# EAGLE design edison_mezzanine_pi_breakout (EAGLE 6.5.0)

## Sheet 1 of 2
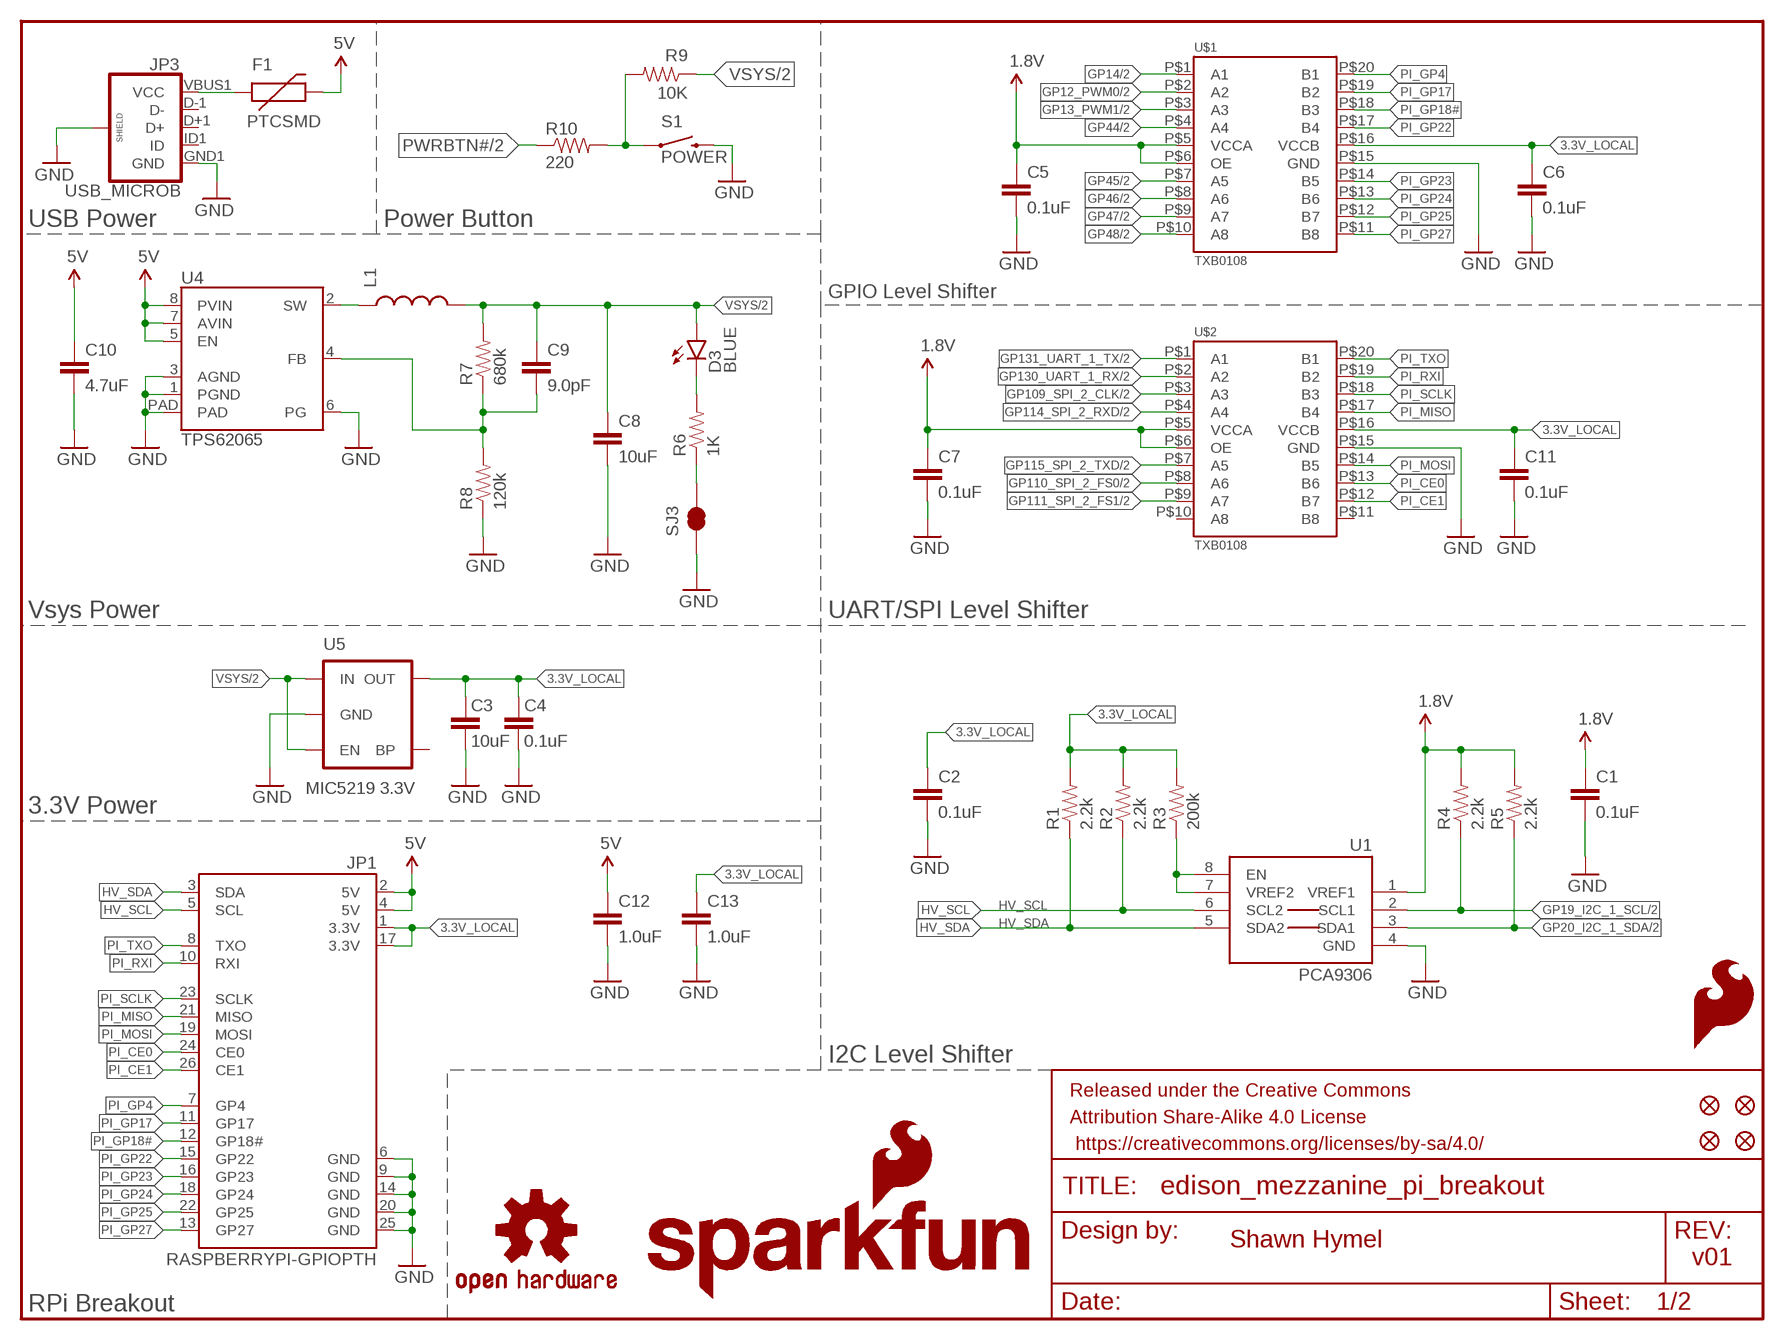
[diagram p0: schematic, sheet 1]

### Parts
C1  0.1uF  0.1UF-25V(+80/-20%)(0603)  [0603-CAP]
C2  0.1uF  0.1UF-25V(+80/-20%)(0603)  [0603-CAP]
C3  10uF  CAP0805  [0805]
C4  0.1uF  0.1UF-25V(+80/-20%)(0603)  [0603-CAP]
C5  0.1uF  0.1UF-25V(+80/-20%)(0603)  [0603-CAP]
C6  0.1uF  0.1UF-25V(+80/-20%)(0603)  [0603-CAP]
C7  0.1uF  0.1UF-25V(+80/-20%)(0603)  [0603-CAP]
C8  10uF  10UF-6.3V-20%(1206)  [1206]
C9  9.0pF  9.0PF-50V-10%(0603)  [0603-CAP]
C10  4.7uF  4.7UF-6.3V-10%(0603)0603  [0603-CAP]
C11  0.1uF  0.1UF-25V(+80/-20%)(0603)  [0603-CAP]
C12  1.0uF  1.0UF-16V-10%(0603)  [0603-CAP]
C13  1.0uF  1.0UF-16V-10%(0603)  [0603-CAP]
D3  BLUE  LED-BLUE0603  [LED-0603]
F1  PTCSMD  [PTC-1206]
FID1  FIDUCIAL1X2  [FIDUCIAL-1X2]
FID2  FIDUCIAL1X2  [FIDUCIAL-1X2]
FID3  FIDUCIAL1X2  [FIDUCIAL-1X2]
FID4  FIDUCIAL1X2  [FIDUCIAL-1X2]
FRAME1  FRAME-LETTER  [CREATIVE_COMMONS]
JP1  RASPBERRYPI-GPIOPTH  [2X13-SHROUDED]
JP3  USB_MICROB  USB_MICROB_PLUGCONN-11752  [USB-B-MICRO-SMD_V03]
L1  INDUCTOR  [INDUCTOR-SRP4020]
LOGO1  OSHW-LOGOS  [OSHW-LOGO-S]
LOGO3  SFE_LOGO_FLAME.1_INCH  [SFE_LOGO_FLAME_.1]
LOGO4  SFE_LOGO_NAME_FLAME.1_INCH  [SFE_LOGO_NAME_FLAME_.1]
R1  2.2k  2.2KOHM1/10W1%(0603)  [0603-RES]
R2  2.2k  2.2KOHM1/10W1%(0603)  [0603-RES]
R3  200k  200KOHM1/10W1%(0603)200K  [0603-RES]
R4  2.2k  2.2KOHM1/10W1%(0603)  [0603-RES]
R5  2.2k  2.2KOHM1/10W1%(0603)  [0603-RES]
R6  1K  1KOHM1/10W1%(0603)  [0603-RES]
R7  680k  RESISTOR0603  [0603-RES]
R8  120k  RESISTOR0603  [0603-RES]
R9  10K  10KOHM1/10W1%(0603)0603  [0603-RES]
R10  220  RESISTOR0603  [0603-RES]
S1  POWER  SWITCH-MOMENTARY-2-SMD-1101NE  [TACTILE-SWITCH-1101NE]
SJ3  JUMPER-PAD-2-NC_BY_TRACE  [PAD-JUMPER-2-NC_BY_TRACE_YES_SILK]
U1  PCA9306  PCA9306PCA9306DC-1:1  [PCA9306DC-1:1]
U4  TPS62065  [WSON-8-PAD]
U5  MIC5219 3.3V  V_REG_MIC52193.3V  [SOT23-5]
U$1  TXB0108  [UFDFN-20]
U$2  TXB0108  [UFDFN-20]

### Nets
1.8V: C1.1 C5.1 C7.1 R4.2 R5.2 U1.1(VREF1) U$1.P$5(VCCA) U$1.P$6(OE) U$2.P$5(VCCA) U$2.P$6(OE) ; also sheet 2
3.3V_LOCAL: C2.1 C3.1 C4.1 C6.1 C11.1 C13.1 JP1.1(3.3V) JP1.17(3.3V) R1.2 R2.2 R3.2 U5.5(OUT) U$1.P$16(VCCB) U$2.P$16(VCCB)
5V: C10.1 C12.1 F1.2 JP1.2(5V) JP1.4(5V) U4.5(EN) U4.7(AVIN) U4.8(PVIN)
GND: C1.2 C2.2 C3.2 C4.2 C5.2 C6.2 C7.2 C8.2 C10.2 C11.2 C12.2 C13.2 JP1.6(GND) JP1.9(GND) JP1.14(GND) JP1.20(GND) JP1.25(GND) JP3.GND1(GND) JP3.SHIELD1(SHIELD) JP3.SHIELD2(SHIELD) JP3.SHIELD3(SHIELD) R8.1 S1.P$2 SJ3.1 U1.4(GND) U4.1(PGND) U4.3(AGND) U4.6(PG) U4.PAD U5.2(GND) U$1.P$15(GND) U$2.P$15(GND) ; also sheet 2
GP12_PWM0: U$1.P$2(A2) ; also sheet 2
GP13_PWM1: U$1.P$3(A3) ; also sheet 2
GP14: U$1.P$1(A1) ; also sheet 2
GP19_I2C_1_SCL: R4.1 U1.2(SCL1) ; also sheet 2
GP20_I2C_1_SDA: R5.1 U1.3(SDA1) ; also sheet 2
GP44: U$1.P$4(A4) ; also sheet 2
GP45: U$1.P$7(A5) ; also sheet 2
GP46: U$1.P$8(A6) ; also sheet 2
GP47: U$1.P$9(A7) ; also sheet 2
GP48: U$1.P$10(A8) ; also sheet 2
GP109_SPI_2_CLK: U$2.P$3(A3) ; also sheet 2
GP110_SPI_2_FS0: U$2.P$8(A6) ; also sheet 2
GP111_SPI_2_FS1: U$2.P$9(A7) ; also sheet 2
GP114_SPI_2_RXD: U$2.P$4(A4) ; also sheet 2
GP115_SPI_2_TXD: U$2.P$7(A5) ; also sheet 2
GP130_UART_1_RX: U$2.P$2(A2) ; also sheet 2
GP131_UART_1_TX: U$2.P$1(A1) ; also sheet 2
HV_SCL: JP1.5(SCL) R2.1 U1.6(SCL2)
HV_SDA: JP1.3(SDA) R1.1 U1.5(SDA2)
N$1: R3.1 U1.7(VREF2) U1.8(EN)
N$2: F1.1 JP3.VBUS1(VCC)
N$12: D3.C R6.2
N$13: R6.1 SJ3.2
N$15: R9.2 R10.2 S1.P$1
N$18: C9.2 R7.1 R8.2 U4.4(FB)
N$19: L1.P$1 U4.2(SW)
PI_CE0: JP1.24(CE0) U$2.P$13(B6)
PI_CE1: JP1.26(CE1) U$2.P$12(B7)
PI_GP4: JP1.7(GP4) U$1.P$20(B1)
PI_GP17: JP1.11(GP17) U$1.P$19(B2)
PI_GP18#: JP1.12(GP18#) U$1.P$18(B3)
PI_GP22: JP1.15(GP22) U$1.P$17(B4)
PI_GP23: JP1.16(GP23) U$1.P$14(B5)
PI_GP24: JP1.18(GP24) U$1.P$13(B6)
PI_GP25: JP1.22(GP25) U$1.P$12(B7)
PI_GP27: JP1.13(GP27) U$1.P$11(B8)
PI_MISO: JP1.21(MISO) U$2.P$17(B4)
PI_MOSI: JP1.19(MOSI) U$2.P$14(B5)
PI_RXI: JP1.10(RXI) U$2.P$19(B2)
PI_SCLK: JP1.23(SCLK) U$2.P$18(B3)
PI_TXO: JP1.8(TXO) U$2.P$20(B1)
PWRBTN#: R10.1 ; also sheet 2
VSYS: C8.1 C9.1 D3.A L1.P$2 R7.2 R9.1 U5.1(IN) U5.3(EN) ; also sheet 2
Unconnected: JP3.D+1(D+) JP3.D-1(D-) JP3.ID1(ID) U5.4(BP) U$2.P$10(A8) U$2.P$11(B8)

### Notes on the sheet
- USB Power | Power Button
- GPIO Level Shifter
- Vsys Power | UART/SPI Level Shifter
- 3.3V Power
- I2C Level Shifter
- Shawn Hymel
- v01
- RPi Breakout

## Sheet 2 of 2
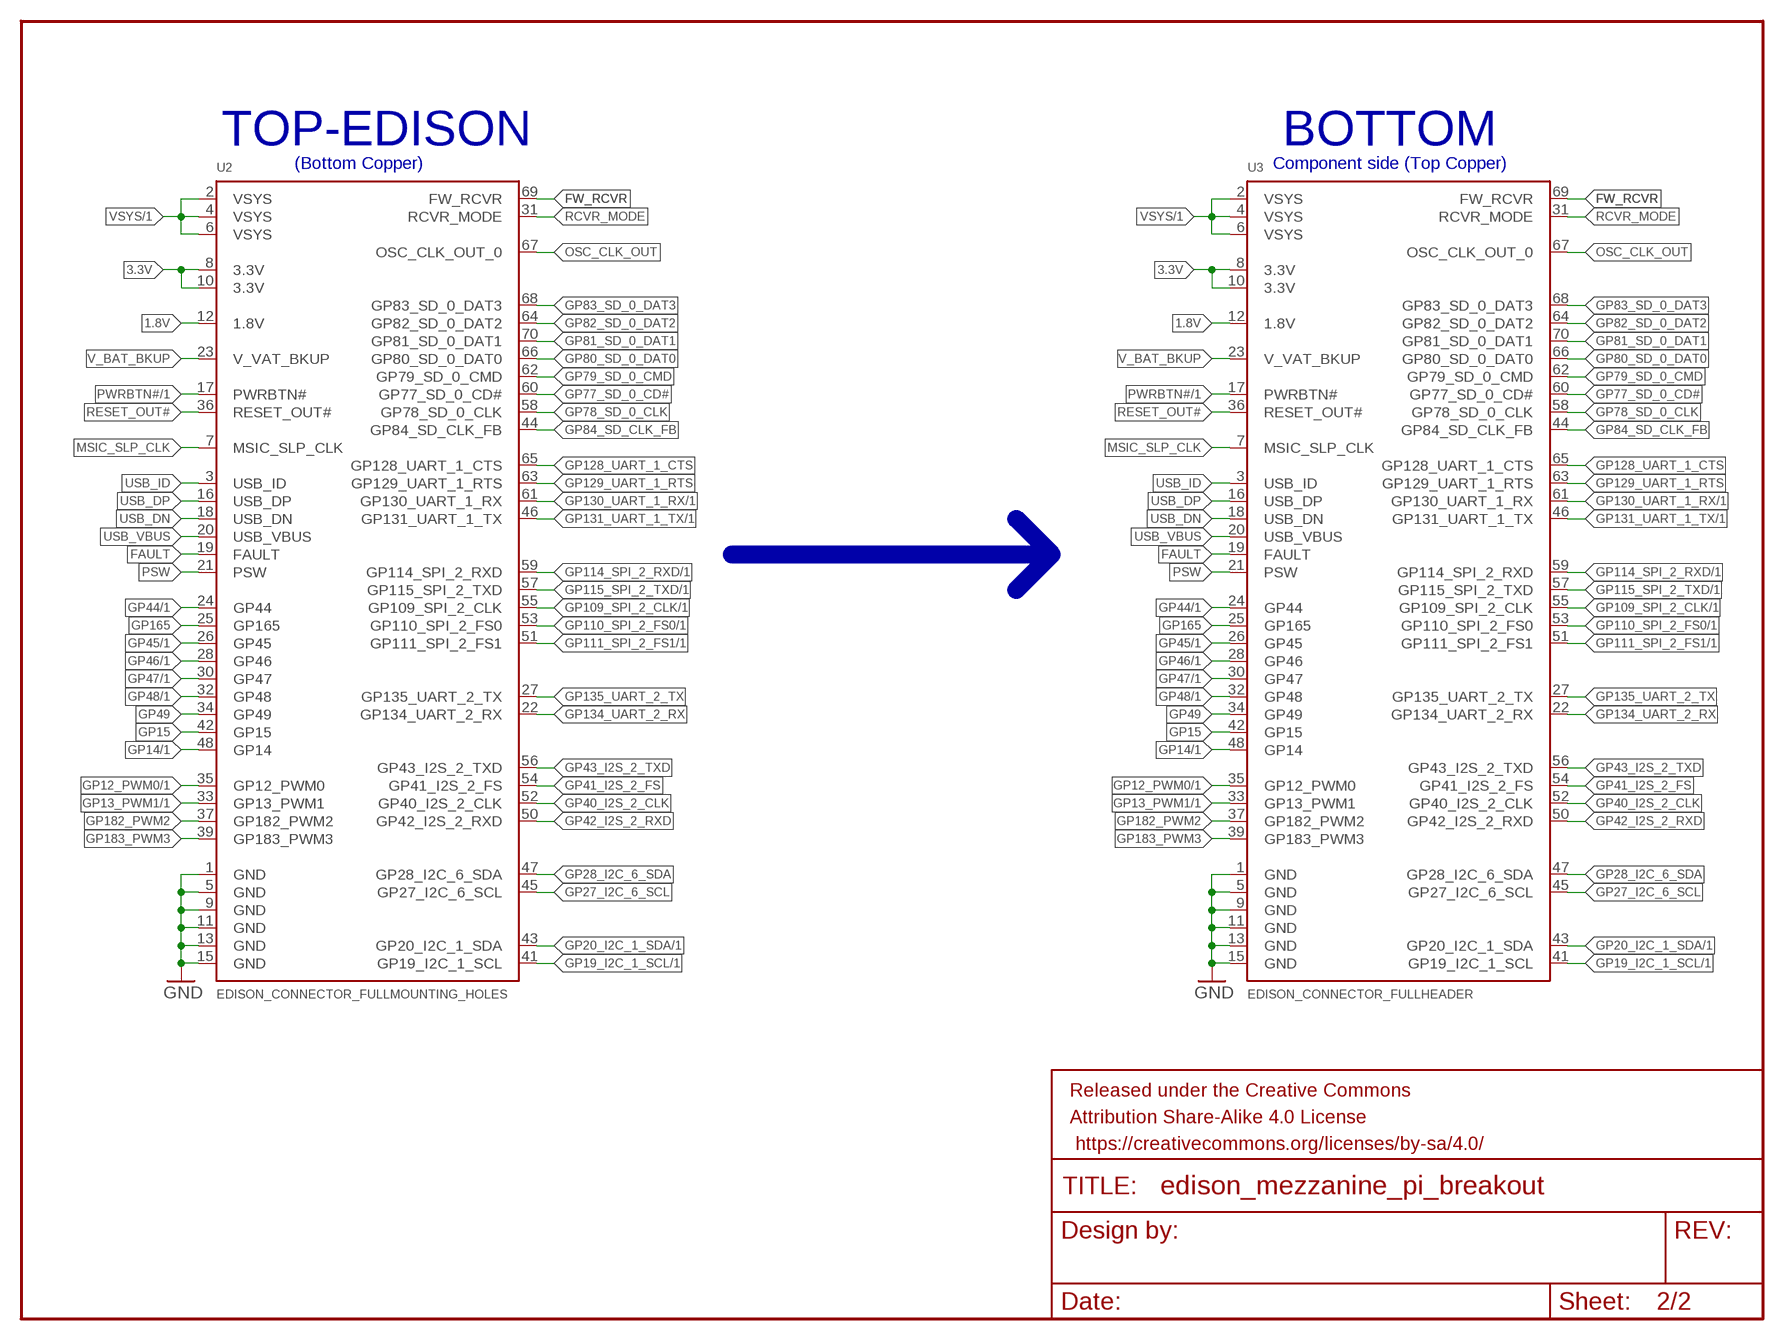
[diagram p1: schematic, sheet 2]

### Parts
FRAME2  FRAME-LETTER  [CREATIVE_COMMONS]
U2  EDISON_CONNECTOR_FULLMOUNTING_HOLES  [EDISON_DAUGHTER]
U3  EDISON_CONNECTOR_FULLHEADER  [DF40C-70DP-0.4(51)]

### Nets
1.8V: U2.12(1.8V) U3.12(1.8V) ; also sheet 1
3.3V: U2.8(3.3V) U2.10(3.3V) U3.8(3.3V) U3.10(3.3V)
FAULT: U2.19(FAULT) U3.19(FAULT)
FW_RCVR: U2.69(FW_RCVR) U3.69(FW_RCVR)
GND: U2.1(GND) U2.5(GND) U2.9(GND) U2.11(GND) U2.13(GND) U2.15(GND) U3.1(GND) U3.5(GND) U3.9(GND) U3.11(GND) U3.13(GND) U3.15(GND) ; also sheet 1
GP12_PWM0: U2.35(GP12_PWM0) U3.35(GP12_PWM0) ; also sheet 1
GP13_PWM1: U2.33(GP13_PWM1) U3.33(GP13_PWM1) ; also sheet 1
GP14: U2.48(GP14) U3.48(GP14) ; also sheet 1
GP15: U2.42(GP15) U3.42(GP15)
GP19_I2C_1_SCL: U2.41(GP19_I2C_1_SCL) U3.41(GP19_I2C_1_SCL) ; also sheet 1
GP20_I2C_1_SDA: U2.43(GP20_I2C_1_SDA) U3.43(GP20_I2C_1_SDA) ; also sheet 1
GP27_I2C_6_SCL: U2.45(GP27_I2C_6_SCL) U3.45(GP27_I2C_6_SCL)
GP28_I2C_6_SDA: U2.47(GP28_I2C_6_SDA) U3.47(GP28_I2C_6_SDA)
GP40_I2S_2_CLK: U2.52(GP40_I2S_2_CLK) U3.52(GP40_I2S_2_CLK)
GP41_I2S_2_FS: U2.54(GP41_I2S_2_FS) U3.54(GP41_I2S_2_FS)
GP42_I2S_2_RXD: U2.50(GP42_I2S_2_RXD) U3.50(GP42_I2S_2_RXD)
GP43_I2S_2_TXD: U2.56(GP43_I2S_2_TXD) U3.56(GP43_I2S_2_TXD)
GP44: U2.24(GP44) U3.24(GP44) ; also sheet 1
GP45: U2.26(GP45) U3.26(GP45) ; also sheet 1
GP46: U2.28(GP46) U3.28(GP46) ; also sheet 1
GP47: U2.30(GP47) U3.30(GP47) ; also sheet 1
GP48: U2.32(GP48) U3.32(GP48) ; also sheet 1
GP49: U2.34(GP49) U3.34(GP49)
GP77_SD_0_CD#: U2.60(GP77_SD_0_CD#) U3.60(GP77_SD_0_CD#)
GP78_SD_0_CLK: U2.58(GP78_SD_0_CLK) U3.58(GP78_SD_0_CLK)
GP79_SD_0_CMD: U2.62(GP79_SD_0_CMD) U3.62(GP79_SD_0_CMD)
GP80_SD_0_DAT0: U2.66(GP80_SD_0_DAT0) U3.66(GP80_SD_0_DAT0)
GP81_SD_0_DAT1: U2.70(GP81_SD_0_DAT1) U3.70(GP81_SD_0_DAT1)
GP82_SD_0_DAT2: U2.64(GP82_SD_0_DAT2) U3.64(GP82_SD_0_DAT2)
GP83_SD_0_DAT3: U2.68(GP83_SD_0_DAT3) U3.68(GP83_SD_0_DAT3)
GP84_SD_CLK_FB: U2.44(GP84_SD_CLK_FB) U3.44(GP84_SD_CLK_FB)
GP109_SPI_2_CLK: U2.55(GP109_SPI_2_CLK) U3.55(GP109_SPI_2_CLK) ; also sheet 1
GP110_SPI_2_FS0: U2.53(GP110_SPI_2_FS0) U3.53(GP110_SPI_2_FS0) ; also sheet 1
GP111_SPI_2_FS1: U2.51(GP111_SPI_2_FS1) U3.51(GP111_SPI_2_FS1) ; also sheet 1
GP114_SPI_2_RXD: U2.59(GP114_SPI_2_RXD) U3.59(GP114_SPI_2_RXD) ; also sheet 1
GP115_SPI_2_TXD: U2.57(GP115_SPI_2_TXD) U3.57(GP115_SPI_2_TXD) ; also sheet 1
GP128_UART_1_CTS: U2.65(GP128_UART_1_CTS) U3.65(GP128_UART_1_CTS)
GP129_UART_1_RTS: U2.63(GP129_UART_1_RTS) U3.63(GP129_UART_1_RTS)
GP130_UART_1_RX: U2.61(GP130_UART_1_RX) U3.61(GP130_UART_1_RX) ; also sheet 1
GP131_UART_1_TX: U2.46(GP131_UART_1_TX) U3.46(GP131_UART_1_TX) ; also sheet 1
GP134_UART_2_RX: U2.22(GP134_UART_2_RX) U3.22(GP134_UART_2_RX)
GP135_UART_2_TX: U2.27(GP135_UART_2_TX) U3.27(GP135_UART_2_TX)
GP165: U2.25(GP165) U3.25(GP165)
GP182_PWM2: U2.37(GP182_PWM2) U3.37(GP182_PWM2)
GP183_PWM3: U2.39(GP183_PWM3) U3.39(GP183_PWM3)
MSIC_SLP_CLK: U2.7(MSIC_SLP_CLK) U3.7(MSIC_SLP_CLK)
OSC_CLK_OUT: U2.67(OSC_CLK_OUT_0) U3.67(OSC_CLK_OUT_0)
PSW: U2.21(PSW) U3.21(PSW)
PWRBTN#: U2.17(PWRBTN#) U3.17(PWRBTN#) ; also sheet 1
RCVR_MODE: U2.31(RCVR_MODE) U3.31(RCVR_MODE)
RESET_OUT#: U2.36(RESET_OUT#) U3.36(RESET_OUT#)
USB_DN: U2.18(USB_DN) U3.18(USB_DN)
USB_DP: U2.16(USB_DP) U3.16(USB_DP)
USB_ID: U2.3(USB_ID) U3.3(USB_ID)
USB_VBUS: U2.20(USB_VBUS) U3.20(USB_VBUS)
V_BAT_BKUP: U2.23(V_VAT_BKUP) U3.23(V_VAT_BKUP)
VSYS: U2.2(VSYS) U2.4(VSYS) U2.6(VSYS) U3.2(VSYS) U3.4(VSYS) U3.6(VSYS) ; also sheet 1

### Buses
B$1

### Notes on the sheet
- TOP-EDISON | BOTTOM
- (Bottom Copper) | Component side (Top Copper)

## Library data of the parts
C1 C2 C4-C7 C11 = SparkFun-Capacitors:0.1UF-25V(+80/-20%)(0603): CAP-00810 Ceramic Standard decoupling cap; PROD_ID: CAP-00810
C3 = SparkFun-Capacitors:CAP: Capacitor Standard 0603 ceramic capacitor, and 0.1" leaded capacitor.; PROD_ID: CAP-11330
C8 = SparkFun-Capacitors:10UF-6.3V-20%(1206): CAP-10057 Ceramic; PROD_ID: CAP-10057
C9 = SparkFun-Capacitors:9.0PF-50V-10%(0603): CAP-09341; PROD_ID: CAP-09341
C10 = SparkFun-Capacitors:4.7UF-6.3V-10%(0603): CAP-08280; PROD_ID: CAP-08280
C12 C13 = SparkFun-Capacitors:1.0UF-16V-10%(0603): CAP-00868; PROD_ID: CAP-00868
D3 = SparkFun-LED:LED-BLUE: Blue LEDs for production use Various blue LEDs stocked by SparkFun production 0603 - DIO-08575 Rebel - DIO-09553 1206 - DIO-09911; PROD_ID: DIO-08575
F1 = SparkFun-PowerIC:PTC: Resettable Fuse PTC Resettable Fuse. Spark Fun Electronics SKU : COM-08357; PROD_ID: RES-11150
FID1-FID4 = SparkFun-Aesthetics:FIDUCIAL: Fiducial Alignment Points Various fiducial points for machine vision alignment.
FRAME1 FRAME2 = SparkFun-Aesthetics:FRAME-LETTER: Schematic Frame Standard 8.5x11 US Letter frame
JP1 = SparkFun-Boards:RASPBERRYPI-GPIO: RASPBERRY PI I/O HEADER As defined for the Revistion 2 Pi.; DIST: sparkfun; DIST_ID: PRT-11490
JP3 = SparkFun-Connectors:USB_MICROB_PLUG: USB Micro-B connectors Some male, some female. Watch your step!; PROD_ID: CONN-11752
L1 = SparkFun-Passives:INDUCTOR: Inductors Basic Inductor/Choke - 0603 and 1206. Footprints are not proven and vary greatly between part numbers. SRN6045- 33uH, 20% 1.4A SDR0403-560KL - 56uH, 10%, 500mA RMS/740mA peak
LOGO1 = SparkFun-Aesthetics:OSHW-LOGO: Open Source Hardware Logo This logo indicates the piece of hardware it is found on incorporates a OSHW license and/or adheres to the definition of open source hardware found here: http://freedomdefined.org/OSHW
LOGO3 = SparkFun-Aesthetics:SFE_LOGO_FLAME: SFE Logo, flame only This is the SparkFun flame logo. The logo on the schematic will always be the same size; the package variant is the height of the flame. Default layer for the logo on the board is tSilk.
LOGO4 = SparkFun-Aesthetics:SFE_LOGO_NAME_FLAME: SFE Logo, name and flame This is the SparkFun full logo. The logo on the schematic will always be the same size; the package variant is the height of the flame part of the logo. Default layer for the logo on the board is tSilk.
R1 R2 R4 R5 = SparkFun-Resistors:2.2KOHM1/10W1%(0603): RES-08272; PROD_ID: RES-08272
R3 = SparkFun-Resistors:200KOHM1/10W1%(0603): RES-09385; PROD_ID: RES-09385
R6 = SparkFun-Resistors:1KOHM1/10W1%(0603): RES-07856; PROD_ID: RES-07856
R7 R8 = SparkFun-Resistors:RESISTOR: Resistor Basic schematic elements and footprints for 0603, 1206, and PTH resistors.
R9 = SparkFun-Resistors:10KOHM1/10W1%(0603): RES-00824; PROD_ID: RES-00824
R10 = SparkFun-Resistors:RESISTOR: Resistor Basic schematic elements and footprints for 0603, 1206, and PTH resistors.; PROD_ID: RES-07861
S1 = SparkFun-Electromechanical:SWITCH-MOMENTARY-2: Various NO switches- pushbuttons, reed, etc
SJ3 = SparkFun-Passives:JUMPER-PAD-2-NC_BY_TRACE
U1 = SparkFun-DigitalIC:PCA9306: Bidirectional I2C level shifter. NOT compatible with all available part number pinout schemes- DOUBLE CHECK!!!; PROD_ID: IC-10023
U2 U3 = Edison:EDISON_CONNECTOR_FULL
U4 = Testing:TPS62065: Texas Instruments TPS62172 3-17V 0.5A Step-Down Converter with DCS control. Available in adjustable and fixed output voltage versions. Is packaged in an 8-pin WSON package measuring 2 × 2 mm (DSG). See a 3.3V fixed output version of this chip in action on the Electric Imp Breakout Board <https://www.sparkfun.com/products/11400>. Datasheet <http://www.ti.com/lit/gpn/tps62172>
U5 = SparkFun-PowerIC:V_REG_MIC5219: V_REG MIC5219 Standard 3.3V and 5V 500mA LDO voltage regulator in SOT-23 layout. Micrel part MIC5219. BP (by-pass) pin is used to lower output noise with 470pF cap, may be left open.; PROD_ID: VREG-09872
U$1 U$2 = Testing:TXB0108

## Board
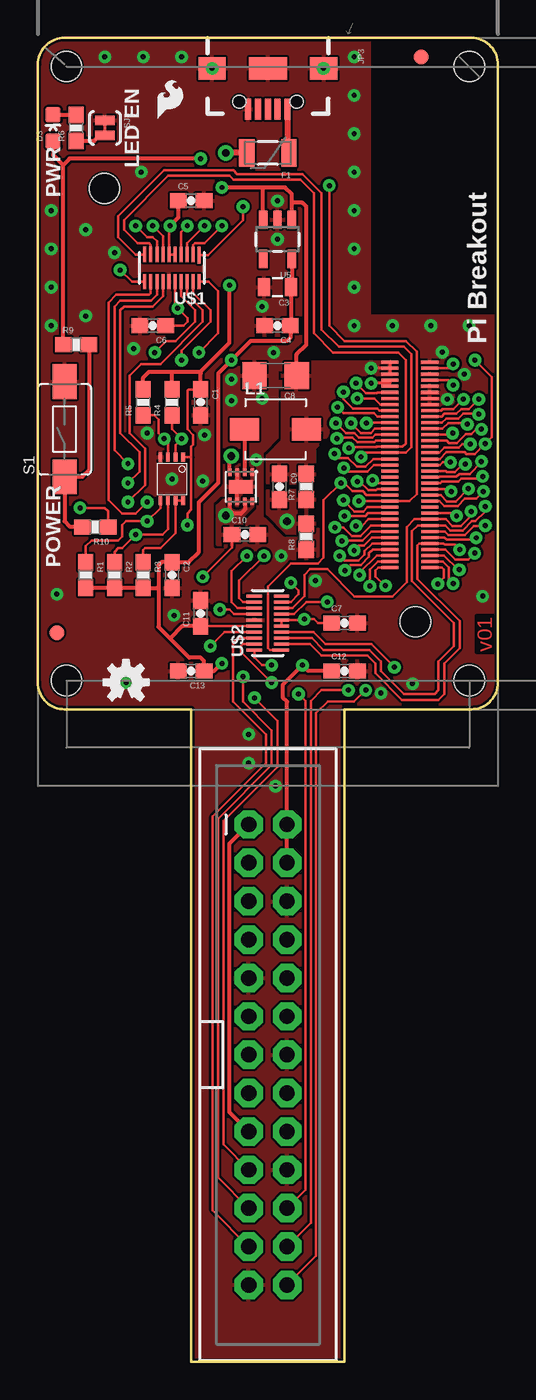
[diagram p2: board, top side]
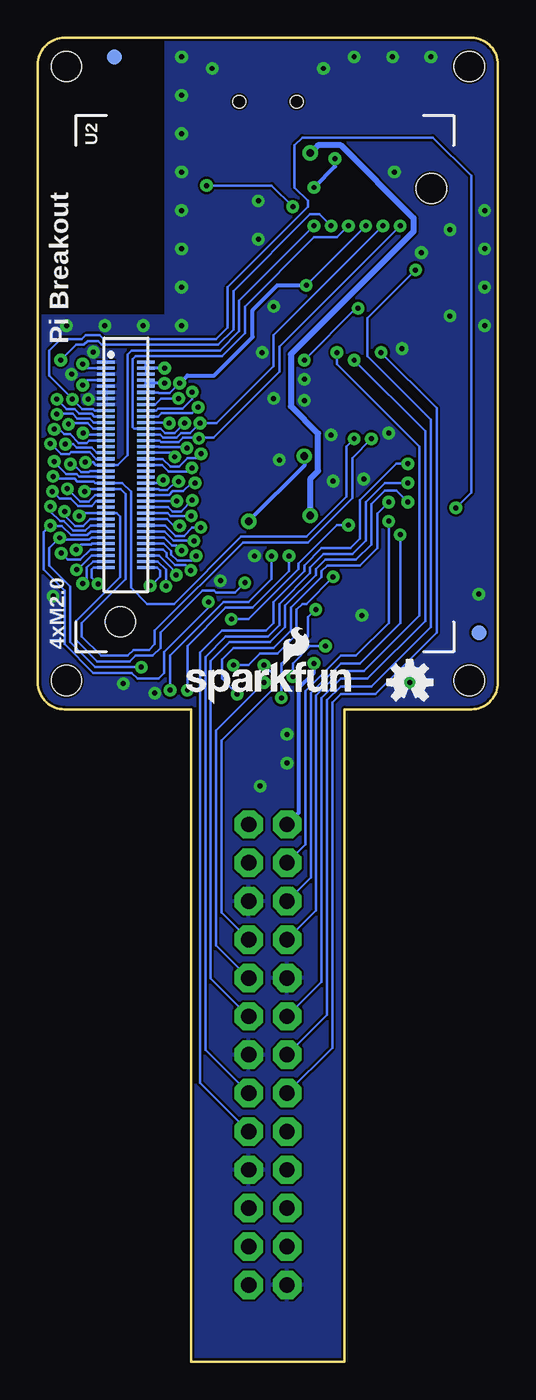
[diagram p3: board, bottom side, seen from below]

Size 30.48 x 87.63 mm. Coordinates in mm from the lower left corner, seen from the top.
Outline: 30.48,85.85 30.48,44.96 arc-90 28.7,43.18 20.32,43.18 20.32,0 10.16,0 10.16,43.18 1.78,43.18 arc-90 0,44.96 0,85.85 arc-90 1.78,87.63 28.7,87.63 arc-90 30.48,85.85
Copper layers (1*16): Top 0.035mm / dielectric 1.5mm / Bottom 0.035mm
Design rules "SparkFun-2-layer *": minimum track width 6mil, minimum drill 13mil, track to track 6mil, track to pad 6mil, pad to pad 6mil, via to via 6mil, smd to smd 6mil, copper to edge 6mil, drill to drill 6mil, minimum pad ring 12mil, minimum via ring 10mil, stop-mask expansion 4mil, vias tented up to drill 20mil, thermal gap 6mil
Holes 2 mm at 28.57,45.09 1.91,45.09 1.91,85.72 28.57,85.72
tRestrict: area 22.1,69.3 to 30.5,87.6
bRestrict: area 22.1,69.3 to 30.5,87.6

### Footprints (pad centres in the part's own frame; a part is rotated, then mirrored left to right if it is on the bottom)
0603-CAP = smd 1.1 x 1: 1 -0.85,0; 2 0.85,0
0805 = smd 0.8 x 1.2: 1 -0.9,0; 2 0.9,0
1206 = smd 1.6 x 1.8: 1 -1.4,0; 2 1.4,0
LED-0603 = smd 1 x 1: A 0,-0.877; C 0,0.877
PTC-1206 = smd 1 x 1.8: 1 -1.4,0; 2 1.4,0
FIDUCIAL-1X2 = smd 1 x 1: 1 0,0
2X13-SHROUDED = drill 1.016 pad 1.88 octagon: 1 -1.27,15.24; 2 1.27,15.24; 3 -1.27,12.7; 4 1.27,12.7; 5 -1.27,10.16; 6 1.27,10.16; 7 -1.27,7.62; 8 1.27,7.62; 9 -1.27,5.08; 10 1.27,5.08; 11 -1.27,2.54; 12 1.27,2.54; 13 -1.27,0; 14 1.27,0; 15 -1.27,-2.54; 16 1.27,-2.54; 17 -1.27,-5.08; 18 1.27,-5.08; 19 -1.27,-7.62; 20 1.27,-7.62; 21 -1.27,-10.16; 22 1.27,-10.16; 23 -1.27,-12.7; 24 1.27,-12.7; 25 -1.27,-15.24; 26 1.27,-15.24
USB-B-MICRO-SMD_V03 = smd 1.4 x 0.4: D+1 2.7,0; D-1 2.7,0.65; GND1 2.7,-1.3; ID1 2.7,-0.65; VBUS1 2.7,1.3 | smd 1.5 x 1.8: SHIELD1 0,3.7; SHIELD2 0,-3.7 | smd 1.5 x 2.5: SHIELD3 0,0 | hole 0.85: 2.2,1.9; 2.2,-1.9
INDUCTOR-SRP4020 = smd 1.9 x 1.5: P$1 -2.05,0; P$2 2.05,0
0603-RES = smd 1.1 x 1: 1 -0.85,0; 2 0.85,0
TACTILE-SWITCH-1101NE = smd 2.3 x 1.6: P$1 -3.15,0; P$2 3.15,0
PAD-JUMPER-2-NC_BY_TRACE_YES_SILK = smd 0.635 x 1.27: 1 -0.508,0; 2 0.508,0
PCA9306DC-1:1 = smd 0.25 x 0.602: 1 -0.73,-1.446; 2 -0.23,-1.446; 3 0.27,-1.446; 4 0.77,-1.446; 5 0.77,1.431; 6 0.27,1.431; 7 -0.23,1.431; 8 -0.73,1.431
EDISON_DAUGHTER = smd 1.14 x 0.2: 1 1.98,19.17; 2 4.62,19.17; 3 1.98,18.77; 4 4.62,18.77; 5 1.98,18.37; 6 4.62,18.37; 7 1.98,17.97; 8 4.62,17.97; 9 1.98,17.57; 10 4.62,17.57; 11 1.98,17.17; 12 4.62,17.17; 13 1.98,16.77; 14 4.62,16.77; 15 1.98,16.37; 16 4.62,16.37; 17 1.98,15.97; 18 4.62,15.97; 19 1.98,15.57; 20 4.62,15.57; 21 1.98,15.17; 22 4.62,15.17; 23 1.98,14.77; 24 4.62,14.77; 25 1.98,14.37; 26 4.62,14.37; 27 1.98,13.97; 28 4.62,13.97; 29 1.98,13.57; 30 4.62,13.57; 31 1.98,13.17; 32 4.62,13.17; 33 1.98,12.77; 34 4.62,12.77; 35 1.98,12.37; 36 4.62,12.37; 37 1.98,11.97; 38 4.62,11.97; 39 1.98,11.57; 40 4.62,11.57; 41 1.98,11.17; 42 4.62,11.17; 43 1.98,10.77; 44 4.62,10.77; 45 1.98,10.37; 46 4.62,10.37; 47 1.98,9.97; 48 4.62,9.97; 49 1.98,9.57; 50 4.62,9.57; 51 1.98,9.17; 52 4.62,9.17; 53 1.98,8.77; 54 4.62,8.77; 55 1.98,8.37; 56 4.62,8.37; 57 1.98,7.97; 58 4.62,7.97; 59 1.98,7.57; 60 4.62,7.57; 61 1.98,7.17; 62 4.62,7.17; 63 1.98,6.77; 64 4.62,6.77; 65 1.98,6.37; 66 4.62,6.37; 67 1.98,5.97; 68 4.62,5.97; 69 1.98,5.57; 70 4.62,5.57 | hole 2: 23.53,30.67; 2.93,1.98
DF40C-70DP-0.4(51) = smd 0.2 x 1.14 bottom: 1 6.8,1.32; 2 6.8,-1.32; 3 6.4,1.32; 4 6.4,-1.32; 5 6,1.32; 6 6,-1.32; 7 5.6,1.32; 8 5.6,-1.32; 9 5.2,1.32; 10 5.2,-1.32; 11 4.8,1.32; 12 4.8,-1.32; 13 4.4,1.32; 14 4.4,-1.32; 15 4,1.32; 16 4,-1.32; 17 3.6,1.32; 18 3.6,-1.32; 19 3.2,1.32; 20 3.2,-1.32; 21 2.8,1.32; 22 2.8,-1.32; 23 2.4,1.32; 24 2.4,-1.32; 25 2,1.32; 26 2,-1.32; 27 1.6,1.32; 28 1.6,-1.32; 29 1.2,1.32; 30 1.2,-1.32; 31 0.8,1.32; 32 0.8,-1.32; 33 0.4,1.32; 34 0.4,-1.32; 35 0,1.32; 36 0,-1.32; 37 -0.4,1.32; 38 -0.4,-1.32; 39 -0.8,1.32; 40 -0.8,-1.32; 41 -1.2,1.32; 42 -1.2,-1.32; 43 -1.6,1.32; 44 -1.6,-1.32; 45 -2,1.32; 46 -2,-1.32; 47 -2.4,1.32; 48 -2.4,-1.32; 49 -2.8,1.32; 50 -2.8,-1.32; 51 -3.2,1.32; 52 -3.2,-1.32; 53 -3.6,1.32; 54 -3.6,-1.32; 55 -4,1.32; 56 -4,-1.32; 57 -4.4,1.32; 58 -4.4,-1.32; 59 -4.8,1.32; 60 -4.8,-1.32; 61 -5.2,1.32; 62 -5.2,-1.32; 63 -5.6,1.32; 64 -5.6,-1.32; 65 -6,1.32; 66 -6,-1.32; 67 -6.4,1.32; 68 -6.4,-1.32; 69 -6.8,1.32; 70 -6.8,-1.32
WSON-8-PAD = smd 0.25 x 0.5: 1 -0.75,-0.95; 2 -0.25,-0.95; 3 0.25,-0.95; 4 0.75,-0.95; 5 0.75,0.95; 6 0.25,0.95; 7 -0.25,0.95; 8 -0.75,0.95 | smd 1.6 x 0.9: PAD 0,0
SOT23-5 = smd 0.55 x 1.2: 1 -0.95,-1.3; 2 0,-1.3; 3 0.95,-1.3; 4 0.95,1.3; 5 -0.95,1.3
UFDFN-20 = smd 0.2 x 1.1: P$1 -1.8,-0.85 | smd 0.2 x 1: P$2 -1.4,-0.9; P$3 -1,-0.9; P$4 -0.6,-0.9; P$5 -0.2,-0.9; P$6 0.2,-0.9; P$7 0.6,-0.9; P$8 1,-0.9; P$9 1.4,-0.9; P$10 1.8,-0.9; P$11 1.8,0.9; P$12 1.4,0.9; P$13 1,0.9; P$14 0.6,0.9; P$15 0.2,0.9; P$16 -0.2,0.9; P$17 -0.6,0.9; P$18 -1,0.9; P$19 -1.4,0.9; P$20 -1.8,0.9

### Placement (x,y rotation side)
C1  10.79,63.5 270 top
C2  8.89,52.07 270 top
C3  15.88,71.12 180 top
C4  15.88,68.58 180 top
C5  10.16,76.84 0 top
C6  7.62,68.58 180 top
C7  20.32,48.89 0 top
C8  15.75,65.28 180 top
C9  16,57.91 270 top
C10  13.72,54.74 0 top
C11  10.79,49.53 90 top
C12  20.32,45.72 0 top
C13  10.16,45.72 180 top
D3  1.02,81.66 0 top
F1  15.24,80.01 180 top
FID1  1.27,48.26 0 top
FID2  25.4,86.36 0 top
FID3  1.27,48.26 0 bottom
FID4  25.4,86.36 0 bottom
FRAME1  -1.27,-8.89 0 top  (outside the outline)
FRAME2  -1.27,-8.89 0 top  (outside the outline)
JP1  15.24,20.32 0 top
JP3  15.24,85.6 270 top
L1  15.75,61.72 0 top
LOGO1  5.84,44.96 0 top
LOGO2  OSHW-LOGOS  [OSHW-LOGO-S]  5.84,44.96 0 bottom
LOGO3  7.62,81.91 0 top
LOGO4  21.08,43.43 0 bottom
R1  3.17,52.07 270 top
R2  5.08,52.07 270 top
R3  6.99,52.07 270 top
R4  8.89,63.5 90 top
R5  6.99,63.5 90 top
R6  2.54,81.66 90 top
R7  17.78,57.91 90 top
R8  17.78,54.61 90 top
R9  2.54,67.31 0 top
R10  3.81,55.24 180 top
S1  1.78,61.72 90 top
SJ3  4.45,81.66 270 top
U1  8.89,58.42 180 top
U2  27.94,46.99 0 bottom
U3  24.64,59.36 90 bottom
U4  13.46,57.91 180 top
U5  15.88,74.3 180 top
U$1  8.89,72.39 180 top
U$2  15.24,48.89 90 top

### Tracks (layer width: path | path; a pad name or v marks a point on that pad's centre or on a via)
1.8V  (via drill 0.33)
  Top 0.152: v21.08,64.77 21.74,64.11 22.45,64.11 22.5,64.16 U3.12 | U$1.P$5 U$1.P$6 8.69,75.11 v8.76,75.18 | C1.1 9.99,64.35 9.91,64.26 9.91,61.72 10.29,61.34 10.29,60.71 10.16,60.58 10.16,59.87 | 10.79,65.41 10.67,65.53 | U$2.P$5 U$2.P$6 17.6,49.09 v17.65,49.15 18.29,49.15 18.54,48.89 C7.1 | v9.91,55.37 9.91,56.13 10.16,56.39 10.16,59.87 | U1.1 10.16,59.87
  Top 0.254: C5.1 9.31,75.73 v8.76,75.18 | v12.7,71.25 12.7,67.44 10.79,65.53 10.67,65.53 8.89,65.53 | 8.89,65.53 7.37,65.53 6.99,65.15 R5.2 | C1.1 10.79,65.41 | R4.2 8.89,65.53
  Bottom 0.152: v21.08,64.77 21.74,64.11 22.45,64.11 22.5,64.16 U3.12 | v12.7,71.25 v8.76,75.18 | v9.91,55.37 10.67,55.37 13.21,52.83 13.21,52.45 16.51,49.15 v17.65,49.15
  Bottom 0.254: v12.7,71.25 14.61,71.25 16.26,69.6 16.26,67.82 18.8,65.28 20.57,65.28 v21.08,64.77
3.3V  (via drill 0.33)
  Top 0.2: v22.08,64.76 23.32,64.76 U3.8 U3.10
  Bottom 0.152: 23.32,64.76 U3.10 | U3.10 | U3.8
  Bottom 0.2: v22.08,64.76 23.32,64.76 | U3.10 U3.8
3.3V_LOCAL  (via drill 0.33)
  Top 0.152: C11.1 11.45,48.7 U$2.P$16 | C6.1 9.65,68.58 9.91,68.83 9.91,69.09 v9.27,69.72 9.09,69.9 U$1.P$16
  Top 0.254: R1.2 R2.2 R3.2 7.91,51.22 8,51.31 | JP1.17 12.7,16.51 12.7,34.29 JP1.1 | 8,51.31 8,52.7 8.22,52.92 C2.1 9.99,52.92 10.67,53.59 10.67,56.9 11.96,58.19 11.96,65.43 v12.83,66.29 14.1,67.56 16.51,67.56 16.73,67.78 C4.1 16.77,68.63 C3.1 16.82,71.17 U5.5 | 8,51.31 8,48.64 8.76,47.88 | 8.76,47.88 10.03,46.61 10.79,46.61 11.01,46.39 C13.1 11.68,45.72 v12.19,46.23 | C11.1 9.56,48.68 8.76,47.88
  Bottom 0.152: v9.27,69.72 9.4,69.72 v12.83,66.29
  Bottom 0.254: v12.19,46.23 12.19,45.59 13.21,44.58 13.21,36.32 JP1.1
5V  (via drill 0.33, 0.51)
  Top 0.152: C10.1 12.87,53.89 v10.92,51.94
  Top 0.254: U4.7 13.71,56.39 13.72,56.39 13.46,56.13 12.95,56.13 12.71,56.38 U4.5 | JP1.4 JP1.2 16.51,43.69 16.26,43.94 16.26,44.83 v17.53,46.1 17.91,45.72 C12.1
  Top 0.381: F1.2 v12.45,80.01
  Bottom 0.152: v10.92,51.94 12.7,50.16 12.95,50.16 13.34,49.78 13.34,48.13 14.61,46.86 15.75,46.86 16.51,46.1 v17.53,46.1
  Bottom 0.381: v12.45,56.01 12.45,58.42 11.91,58.95 11.91,61.44 13.72,63.25 13.72,66.67 5.59,74.8 5.59,75.69 10.41,80.52 11.94,80.52 v12.45,80.01
  pour Top (isolate 0.305): 13.46,54.1 11.94,54.1 11.94,56.64 12.57,57.28 14.35,57.28 14.35,56.77 13.46,55.88
FAULT  (via drill 0.33)
  Top 0.152: U3.19 26.75,62.56 26.92,62.74 27.74,62.74 28.04,63.04 28.55,63.04 v29.21,63.7
  Bottom 0.152: v29.21,63.7 28.55,63.04 28.04,63.04 27.74,62.74 26.92,62.74 26.75,62.56 U3.19
FW_RCVR  (via drill 0.33)
  Top 0.152: v26.49,51.49 26.9,51.89 26.9,52.43 26.76,52.56 U3.69
  Bottom 0.152: U3.69 26.76,52.56 26.9,52.43 26.9,51.89 v26.49,51.49
GND  (via drill 0.33)
  Top 0.254: U4.6 13.21,57.66 U4.PAD 13.21,58.16 U4.3
  other vias: 27.13,63.7 28.24,65.35 9.02,49.4 15.88,76.84 11.56,85.6 18.92,85.6 18.39,51.69 16.13,53.34 22.73,44.25 24.82,44.88 7.24,61.47 8.89,58.42 10.92,58.29 11.05,61.34 14.48,59.69 12.83,65.02 12.83,63.63 14.86,63.75 6.35,67.06 5.08,73.41 15.62,66.8 14.86,69.85 20.95,86.36 20.95,83.82 20.95,81.28 20.95,78.74 20.95,76.2 20.95,73.66 20.95,71.12 28.57,68.58 26.04,68.58 23.5,68.58 20.95,68.58 26.8,66.83 9.53,86.36 6.99,86.36 4.45,86.36 3.17,74.93 3.17,69.22 1.27,50.8 5.84,44.96 13.97,41.53 13.97,39.62 15.75,38.1 29.46,50.67 6.86,78.74 0.89,76.2 0.89,73.66 0.89,71.12 0.89,68.58 15.88,74.3
  pour Bottom (rank 6): 30.48,85.85 30.48,44.96 arc-90 28.7,43.18 20.32,43.18 20.32,0 10.16,0 10.16,43.18 1.78,43.18 arc-90 0,44.96 0,85.85 arc-90 1.78,87.63 28.7,87.63 arc-90
  pour Top (rank 6): 30.48,44.91 arc-90 28.75,43.18 20.32,43.18 20.32,0 10.16,0 10.16,43.18 1.78,43.18 arc-90 0,44.96 0,85.85 arc-90 1.78,87.63 28.7,87.63 arc-90 30.48,85.85
GP12_PWM0  (via drill 0.33)
  Top 0.152: U3.35 26.64,59.36 26.82,59.54 v27.33,59.54 | U$1.P$2 10.29,73.92 10.41,74.04 11.05,74.04 v12.19,75.18
  Bottom 0.152: v27.33,59.54 26.82,59.54 26.64,59.36 U3.35 | U3.35 | U3.35 25.2,59.36 24.54,60.02 24.54,66.65 24.26,66.93 18.41,66.93 17.14,68.2 17.14,70.23 v12.19,75.18
GP13_PWM1  (via drill 0.33)
  Top 0.152: U3.33 26.61,59.76 27.05,60.2 28.27,60.2 28.4,60.07 28.93,60.07 29.62,60.76 v29.64,60.76 30.07,61.19 30.07,65.18 v28.96,66.29 | U$1.P$3 9.89,74.03 v11.05,75.18
  Bottom 0.152: U3.33 26.61,59.76 27.05,60.2 28.27,60.2 28.4,60.07 28.93,60.07 29.62,60.76 v29.64,60.76 | v11.05,75.18 11.81,75.95 12.45,75.95 17.53,70.87 17.53,68.33 18.54,67.31 26.24,67.31 26.49,67.56 27.18,67.56 27.43,67.31 27.94,67.31 v28.96,66.29
GP14  (via drill 0.33)
  Top 0.152: U3.48 24.63,56.96 25.09,57.43 25.09,66.85 24.38,67.56 20.32,67.56 19.3,68.58 v19.3,77.85 | U3.48 | U$1.P$1 11.26,73.24 13.59,75.56 v13.59,76.45 | U3.48 v21.27,56.96
  Bottom 0.152: v19.3,77.85 14.99,77.85 v13.59,76.45 | U3.48 v21.27,56.96
GP15  (via drill 0.33)
  Top 0.152: U3.42 22.36,58.16 v22.17,58.34
  Bottom 0.152: v22.17,58.34 22.36,58.16 U3.42
GP19_I2C_1_SCL  (via drill 0.33)
  Top 0.152: U3.41 26.66,58.16 26.77,58.27 27.86,58.27 28.04,58.45 29.31,58.45 v29.46,58.6 | U1.2 9.12,60.68 v9.53,61.09 8.89,61.72 R4.1
  Bottom 0.152: v29.46,58.6 29.31,58.45 28.04,58.45 27.86,58.27 26.77,58.27 26.66,58.16 U3.41 24.89,58.16 24.31,57.58 24.31,51.23 23.24,50.16 21.46,50.16 17.02,54.61 12.7,54.61 10.03,57.28 10.03,60.58 v9.53,61.09
GP20_I2C_1_SDA  (via drill 0.33)
  Top 0.152: U3.43 27.23,57.76 v27.38,57.61 | R5.1 7.71,62.65 8,62.36 8,61.47 v8.38,61.09 8.62,60.85 U1.3
  Bottom 0.152: 27.23,57.76 v27.38,57.61 27.23,57.76 U3.43 | U3.43 | U3.43 24.99,57.76 24.66,57.43 24.66,51.79 27.56,48.89 27.56,48.01 26.29,46.74 24.51,46.74 24.13,47.12 23.11,47.12 22.73,47.5 22.73,48.39 16.89,54.23 12.57,54.23 9.65,57.15 9.65,59.82 v8.38,61.09
GP27_I2C_6_SCL  (via drill 0.33)
  Top 0.152: v28.52,57.78 27.69,56.95 27.1,56.95 26.69,57.36 U3.45
  Bottom 0.152: U3.45 26.69,57.36 27.1,56.95 27.69,56.95 v28.52,57.78
GP28_I2C_6_SDA  (via drill 0.33)
  Top 0.152: U3.47 26.61,56.96 26.92,56.64 27.81,56.64 28.3,57.12 29.03,57.12 v29.52,57.61
  Bottom 0.152: v29.52,57.61 29.03,57.12 28.3,57.12 27.81,56.64 26.92,56.64 26.61,56.96 U3.47
GP40_I2S_2_CLK  (via drill 0.33)
  Top 0.152: U3.52 21.87,56.16 21.69,55.98 v20.32,55.98
  Bottom 0.152: v20.32,55.98 21.69,55.98 21.87,56.16 U3.52
GP41_I2S_2_FS  (via drill 0.33)
  Top 0.152: v21.08,55.32 21.46,55.32 21.9,55.76 U3.54
  Bottom 0.152: U3.54 21.9,55.76 21.46,55.32 v21.08,55.32
GP42_I2S_2_RXD  (via drill 0.33)
  Top 0.152: U3.50 21.84,56.56 21.57,56.29 20.98,56.29 v20.24,57.02
  Bottom 0.152: v20.24,57.02 20.98,56.29 21.57,56.29 21.84,56.56 U3.50
GP43_I2S_2_TXD  (via drill 0.33)
  Top 0.152: U3.56 22.06,55.36 21.36,54.66 20.8,54.66 20.24,55.22 v19.68,55.22
  Bottom 0.152: v19.68,55.22 20.24,55.22 20.8,54.66 21.36,54.66 22.06,55.36 U3.56
GP44  (via drill 0.33)
  Top 0.152: U3.24 22.34,61.76 22.05,61.47 21.41,61.47 v20.75,62.13 | U$1.P$4 9.49,74.77 v9.91,75.18
  Bottom 0.152: v20.75,62.13 21.41,61.47 22.05,61.47 22.34,61.76 U3.24 24.09,61.76 24.18,61.85 24.18,66.37 24,66.55 18.29,66.55 16.76,68.07 16.76,69.85 12.19,74.42 10.67,74.42 v9.91,75.18
GP45  (via drill 0.33)
  Top 0.152: v19.74,62.13 20.4,61.47 20.98,61.47 21.29,61.16 22.17,61.16 22.37,61.36 U3.26 | U$1.P$7 8.29,74.51 v7.62,75.18
  Bottom 0.152: U3.26 22.37,61.36 22.17,61.16 21.29,61.16 20.98,61.47 20.4,61.47 v19.74,62.13 18.64,62.13 14.86,65.91 14.86,67.94 v7.62,75.18
GP46  (via drill 0.33)
  Top 0.152: U3.28 22.4,60.96 22.3,60.86 21.16,60.86 20.85,61.16 19.86,61.16 v19.81,61.11 | U$1.P$8 7.89,74.15 7.62,74.42 7.24,74.42 v6.48,75.18
  Bottom 0.152: v19.81,61.11 19.86,61.16 | 19.86,61.16 20.85,61.16 21.16,60.86 22.3,60.86 22.4,60.96 U3.28 | 19.86,61.16 18.85,61.16 14.48,65.53 14.48,67.18 v6.48,75.18
GP47  (via drill 0.33)
  Top 0.152: v20.6,60.48 20.68,60.55 22.43,60.55 22.43,60.56 U3.30 24.16,60.56 24.38,60.78 24.38,66.29 23.88,66.8 19.56,66.8 18.29,68.07 18.29,77.34 17.4,78.23 12.95,78.23 12.7,78.49 8.64,78.49 5.71,75.56 5.71,74.93 6.6,74.04 7.37,74.04 7.49,73.92 U$1.P$9
  Bottom 0.152: v20.6,60.48 20.68,60.55 22.43,60.55 22.43,60.56 U3.30
GP48  (via drill 0.33)
  Top 0.152: v21.41,59.89 21.68,60.16 U3.32 24.37,60.16 24.74,60.53 24.74,66.7 24.26,67.18 19.94,67.18 18.8,68.33 18.8,77.34 17.53,78.61 13.21,78.61 12.95,78.87 8.38,78.87 5.33,75.82 5.33,74.42 6.47,73.29 U$1.P$10
  Bottom 0.152: U3.32 21.68,60.16 v21.41,59.89
GP49  (via drill 0.33)
  Top 0.152: U3.34 22.22,59.76 21.69,59.23 21.13,59.23 20.55,59.82 19.94,59.82 v19.66,60.1
  Bottom 0.152: v19.66,60.1 19.94,59.82 20.55,59.82 21.13,59.23 21.69,59.23 22.22,59.76 U3.34
GP77_SD_0_CD#  (via drill 0.33)
  Top 0.152: U3.60 22.12,54.56 21.59,54.03 21.29,54.03 v20.95,53.7
  Bottom 0.152: v20.95,53.7 21.29,54.03 21.59,54.03 22.12,54.56 U3.60
GP78_SD_0_CLK  (via drill 0.33)
  Top 0.152: U3.58 22.09,54.96 21.49,54.36 20.17,54.36 v20.14,54.33
  Bottom 0.152: v20.14,54.33 20.17,54.36 21.49,54.36 22.09,54.96 U3.58
GP79_SD_0_CMD  (via drill 0.33)
  Top 0.152: U3.62 22.16,54.16 21.64,53.64 21.64,53.44 21.23,53.03 20.3,53.03 v19.99,53.34
  Bottom 0.152: v19.99,53.34 20.3,53.03 21.23,53.03 21.64,53.44 21.64,53.64 22.16,54.16 U3.62
GP80_SD_0_DAT0  (via drill 0.33)
  Top 0.152: v21.31,52.07 21.31,52.22 22.45,53.36 U3.66
  Bottom 0.152: U3.66 22.45,53.36 21.31,52.22 v21.31,52.07
GP81_SD_0_DAT1  (via drill 0.33)
  Top 0.152: U3.70 22.56,52.56 22.38,52.38 22.38,51.97 22.99,51.36 v23.04,51.36
  Bottom 0.152: v23.04,51.36 22.99,51.36 22.38,51.97 22.38,52.38 22.56,52.56 U3.70
GP82_SD_0_DAT2  (via drill 0.33)
  Top 0.152: U3.64 22.19,53.76 21.95,53.52 21.95,53.29 21.39,52.73 20.7,52.73 v20.34,52.38
  Bottom 0.152: v20.34,52.38 20.7,52.73 21.39,52.73 21.95,53.29 21.95,53.52 22.19,53.76 U3.64
GP83_SD_0_DAT3  (via drill 0.33)
  Top 0.152: v22,51.33 22,52.43 22.53,52.96 U3.68
  Bottom 0.152: U3.68 22.53,52.96 22,52.43 v22,51.33
GP84_SD_CLK_FB  (via drill 0.33)
  Top 0.152: U3.44 22.48,57.76 22.4,57.68 21.9,57.68 21.32,58.27 v21.16,58.27
  Bottom 0.152: v21.16,58.27 21.32,58.27 21.9,57.68 22.4,57.68 22.48,57.76 U3.44 | U3.44
GP109_SPI_2_CLK  (via drill 0.33)
  Top 0.152: v29.64,56.62 29.64,56.29 28.98,55.63 28.75,55.63 28.14,55.02 27.33,55.02 26.99,55.36 U3.55 25.16,55.36 24.79,54.99 24.79,51.66 27.56,48.89 27.56,47.37 26.54,46.35 26.54,44.45 26.29,44.2 24.26,44.2 22.73,45.72 22.73,46.35 21.97,47.12 18.92,47.12 18.14,47.89 U$2.P$3
  Bottom 0.152: v29.64,56.62 29.64,56.29 28.98,55.63 28.75,55.63 28.14,55.02 27.33,55.02 26.99,55.36 U3.55
GP110_SPI_2_FS0  (via drill 0.33)
  Top 0.152: v28.7,56.29 28.7,56.01 28.02,55.32 27.46,55.32 27.02,55.76 U3.53 24.95,55.76 24.43,55.24 24.43,51.61 23.47,50.65 20.98,50.65 19.18,52.45 18.03,52.45 17.65,52.07 17.65,50.67 16.88,49.89 U$2.P$8
  Bottom 0.152: U3.53 27.02,55.76 27.46,55.32 28.02,55.32 28.7,56.01 v28.7,56.29
GP111_SPI_2_FS1  (via drill 0.33)
  Top 0.152: v27.74,55.98 27.56,56.16 U3.51 | U$2.P$9 16.77,50.3 17.27,50.8 17.27,51.05 v16.76,51.56
  Bottom 0.152: 25.25,56.16 25.02,55.93 25.02,51.94 27.94,49.02 27.94,47.75 26.54,46.35 24.38,46.35 24,46.74 22.86,46.74 22.35,47.24 22.35,48.26 19.56,51.05 18.8,51.05 18.67,50.93 17.4,50.93 v16.76,51.56 | 25.25,56.16 | v27.74,55.98 27.56,56.16 U3.51 | U3.51 | U3.51 25.25,56.16 | U3.51
GP114_SPI_2_RXD  (via drill 0.33)
  Top 0.152: U3.59 26.92,54.56 27.08,54.41 28.91,54.41 v29.03,54.53 | v23.62,45.97 22.1,47.5 19.05,47.5 18.25,48.3 U$2.P$4
  Bottom 0.152: U3.59 26.92,54.56 27.08,54.41 28.91,54.41 v29.03,54.53 29.72,53.85 29.72,52.7 28.32,51.31 28.32,47.62 26.67,45.97 v23.62,45.97
GP115_SPI_2_TXD  (via drill 0.33)
  Top 0.152: U3.57 26.95,54.96 27.2,54.71 28.27,54.71 28.88,55.32 29.62,55.32 v29.64,55.35 | U$2.P$7 16.98,49.49 17.78,50.29 v19.18,50.29
  Bottom 0.152: v29.64,55.35 29.62,55.32 28.88,55.32 28.27,54.71 27.2,54.71 26.95,54.96 U3.57 | 29.97,55.02 v29.64,55.35 | v29.64,55.35 30.07,54.91 30.07,52.43 28.7,51.05 28.7,47.5 26.8,45.59 24.26,45.59 23.88,45.21 22.48,45.21 22.1,45.59 22.1,46.99 19.18,49.91 v19.18,50.29
GP128_UART_1_CTS  (via drill 0.33)
  Top 0.152: U3.65 26.9,53.36 27.84,52.43 v27.91,52.43
  Bottom 0.152: v27.91,52.43 27.84,52.43 26.9,53.36 U3.65
GP129_UART_1_RTS  (via drill 0.33)
  Top 0.152: v28.93,53.52 28.5,53.09 27.66,53.09 26.99,53.76 U3.63
  Bottom 0.152: U3.63 26.99,53.76 27.66,53.09 28.5,53.09 v28.93,53.52
GP130_UART_1_RX  (via drill 0.33)
  Top 0.152: v27.94,53.75 27.61,54.08 26.95,54.08 26.87,54.16 U3.61 25.28,54.16 25.15,54.03 25.15,51.82 27.94,49.02 27.94,47.24 26.92,46.23 26.92,44.2 26.54,43.81 24.13,43.81 22.35,45.59 22.35,46.23 21.84,46.74 18.8,46.74 18.04,47.49 U$2.P$2
  Bottom 0.152: U3.61 26.87,54.16 26.95,54.08 27.61,54.08 v27.94,53.75
GP131_UART_1_TX  (via drill 0.33)
  Top 0.152: U3.46 22.52,57.36 22.5,57.38 21.77,57.38 21.54,57.61 20.85,57.61 20.3,58.17 v20.07,58.17 18.92,57.02 18.92,53.21 18.54,52.83 16.76,52.83 15.24,51.31 15.24,47.24 15.39,47.09 U$2.P$1
  Bottom 0.152: v20.07,58.17 20.3,58.17 20.85,57.61 21.54,57.61 21.77,57.38 22.5,57.38 22.52,57.36 U3.46
GP134_UART_2_RX  (via drill 0.33)
  Top 0.152: v21.77,62.13 21.8,62.16 U3.22
  Bottom 0.152: U3.22 21.8,62.16 v21.77,62.13
GP135_UART_2_TX  (via drill 0.33)
  Top 0.152: v29.39,61.72 29.06,61.72 28.73,61.39 28.35,61.39 27.76,60.81 27.23,60.81 27.08,60.96 U3.27
  Bottom 0.152: U3.27 27.08,60.96 27.23,60.81 27.76,60.81 28.35,61.39 28.73,61.39 29.06,61.72 v29.39,61.72
GP165  (via drill 0.33)
  Top 0.152: v27.48,61.47 27.38,61.36 U3.25
  Bottom 0.152: U3.25 27.38,61.36 v27.48,61.47
GP182_PWM2  (via drill 0.33)
  Top 0.152: U3.37 27.02,58.96 27.1,58.88 27.61,58.88 28.14,59.41 v28.32,59.41
  Bottom 0.152: v28.32,59.41 28.14,59.41 27.61,58.88 27.1,58.88 27.02,58.96 U3.37
GP183_PWM3  (via drill 0.33)
  Top 0.152: v29.39,59.59 29.39,59.54 28.6,58.75 27.91,58.75 27.74,58.57 26.62,58.57 26.61,58.56 U3.39
  Bottom 0.152: U3.39 26.61,58.56 26.62,58.57 27.74,58.57 27.91,58.75 28.6,58.75 29.39,59.54 v29.39,59.59
HV_SCL  (via drill 0.33)
  Top 0.152: R2.1 5.08,53.59 5.33,53.85 5.59,53.85 v6.48,54.74 8.26,54.74 8.62,55.1 U1.6
  Bottom 0.152: JP1.5 12.39,32.05 12.39,44.25 10.41,46.23 9.14,46.23 6.48,48.89 v6.48,54.74
HV_SDA  (via drill 0.33)
  Top 0.152: R1.1 3.17,53.98 3.56,54.36 5.33,54.36 5.59,54.61 5.59,55.37 5.84,55.63 v7.24,55.63 8.12,56.51 U1.5
  Bottom 0.152: JP1.3 12.75,34.24 12.75,44.4 10.41,46.74 9.4,46.74 7.24,48.89 v7.24,55.63
MSIC_SLP_CLK  (via drill 0.33)
  Top 0.152: v27.51,64.64 27.19,64.96 U3.7
  Bottom 0.152: U3.7 27.19,64.96 v27.51,64.64
N$1
  Top 0.152: R3.1 6.99,53.72 7.11,53.85 8.13,53.85 9.12,54.84 U1.7 U1.8
N$2
  Top 0.381: JP3.VBUS1 16.54,80.11 F1.1
N$12
  Top 0.254: D3.C 2.51,82.54 R6.2
N$13
  Top 0.254: R6.1 3.75,80.81 3.94,81 4.29,81 SJ3.2
N$15
  Top 0.254: R9.2 3.39,59.02 2.95,58.57 S1.P$1 1.78,55.63 2.16,55.24 R10.2
N$18  (via drill 0.51)
  Top 0.254: U4.4 12.71,59.83 v12.83,59.94
  Bottom 0.254: v12.83,59.94 12.83,59.31 v16.51,55.63
  pour Top: 15.24,57.66 18.29,57.66 18.29,54.86 16.51,54.86 15.24,56.13
N$19
  Top 0.254: U4.2 13.71,61.71 L1.P$1
OSC_CLK_OUT  (via drill 0.33)
  Top 0.152: v27.51,51.51 27.23,51.79 27.23,52.55 26.82,52.96 U3.67
  Bottom 0.152: U3.67 26.82,52.96 27.23,52.55 27.23,51.79 v27.51,51.51
PI_CE0  (via drill 0.33)
  Top 0.152: JP1.24 18.09,9.2 18.09,43.74 18.8,44.45 v20.57,44.45 | U$2.P$13 13.22,49.89 12.83,50.29 12.83,52.32 v13.84,53.34
  Bottom 0.152: v20.57,44.45 20.57,47.37 18.03,49.91 16.26,49.91 13.84,52.32 v13.84,53.34
PI_CE1  (via drill 0.33)
  Top 0.152: JP1.26 18.44,7.01 18.44,42.93 19.2,43.69 20.95,43.69 v21.72,44.45 | U$2.P$12 13.59,50.3 13.34,50.55 13.34,51.69 v14.99,53.34
  Bottom 0.152: v21.72,44.45 21.72,46.74 18.16,50.29 16.51,50.29 14.99,51.82 v14.99,53.34
PI_GP4  (via drill 0.33)
  Top 0.152: U$1.P$20 11.31,71.49 11.94,70.87 11.94,68.07 v10.67,66.8
  Bottom 0.152: JP1.7 12.04,29.87 12.04,44.09 10.41,45.72 8.89,45.72 5.21,49.4 5.21,60.58 10.67,66.04 v10.67,66.8
PI_GP17  (via drill 0.33)
  Top 0.152: v9.53,66.29 9.53,66.93 11.43,68.83 11.43,69.6 10.29,70.74 U$1.P$19
  Bottom 0.152: JP1.11 11.68,25.15 11.68,43.94 10.41,45.21 8.64,45.21 4.83,49.02 4.83,61.59 v9.53,66.29
PI_GP18#  (via drill 0.33)
  Top 0.152: v5.97,56.9 7.11,58.04 7.11,60.45 6.1,61.47 6.1,65.28 6.86,66.04 8.13,66.04 10.92,68.83 10.92,69.6 9.89,70.63 U$1.P$18
  Bottom 0.152: JP1.12 19.02,25.38 19.02,46.38 17.78,47.62 15.11,47.62 14.1,48.64 14.1,50.04 12.06,52.07 12.06,52.45 11.43,53.09 9.4,53.09 8.38,54.1 8.38,56.77 7.49,57.66 6.73,57.66 v5.97,56.9
PI_GP22  (via drill 0.33)
  Top 0.152: v7.75,66.8 8.51,67.56 9.14,67.56 10.41,68.83 10.41,69.6 9.49,70.52 U$1.P$17
  Bottom 0.152: JP1.15 10.97,20.78 10.97,43.64 10.41,44.2 8.13,44.2 4.06,48.26 4.06,63.12 v7.75,66.8
PI_GP23  (via drill 0.33)
  Top 0.152: U$1.P$14 8.29,70.52 7.62,69.85 5.71,69.85 5.46,69.6 5.46,61.47 6.73,60.2 6.73,58.93 v5.97,58.17
  Bottom 0.152: JP1.16 19.38,20.65 19.38,46.66 18.03,48.01 15.24,48.01 14.48,48.77 14.48,50.16 12.45,52.2 12.45,52.58 11.56,53.47 9.65,53.47 8.76,54.36 8.76,56.9 7.49,58.17 v5.97,58.17
PI_GP24  (via drill 0.33)
  Top 0.152: U$1.P$13 7.89,70.63 7.49,70.23 5.46,70.23 5.08,69.85 5.08,60.33 v5.97,59.44
  Bottom 0.152: JP1.18 19.74,18.47 19.74,46.94 18.29,48.39 15.37,48.39 14.86,48.89 14.86,50.29 12.83,52.32 12.83,52.7 11.68,53.85 9.78,53.85 9.14,54.48 9.14,57.02 6.73,59.44 v5.97,59.44
PI_GP25  (via drill 0.33)
  Top 0.152: JP1.22 17.73,11.38 17.73,43.74 v17.27,44.2 | U$1.P$12 7.49,70.74 7.37,70.61 5.21,70.61 4.7,70.1 4.7,57.02 5.59,56.13 6.48,56.13 v7.24,56.9
  Bottom 0.152: v7.24,56.9 8,56.13 8,53.85 9.14,52.7 11.3,52.7 11.68,52.32 11.68,51.94 13.72,49.91 13.72,48.39 14.86,47.24 17.53,47.24 18.29,46.48 18.29,45.21 v17.27,44.2
PI_GP27  (via drill 0.33)
  Top 0.152: U$1.P$11 6.23,71.49 v5.46,72.26
  Bottom 0.152: JP1.13 11.33,22.96 11.33,43.79 10.41,44.7 8.38,44.7 4.45,48.64 4.45,62.36 8.64,66.55 8.64,69.09 v5.46,72.26
PI_MISO  (via drill 0.33)
  Top 0.152: JP1.21 11.94,12.19 11.94,35.94 15.49,39.5 15.49,41.78 13.59,43.69 v13.59,45.34 | U$2.P$17 12.35,48.3 v11.43,47.37
  Bottom 0.152: v11.43,47.37 12.45,47.37 13.59,46.23 v13.59,45.34
PI_MOSI  (via drill 0.33)
  Top 0.152: JP1.19 12.29,14.38 12.29,35.79 15.88,39.37 15.88,42.42 v14.35,43.94 | U$2.P$14 12.99,49.49 12.7,49.78 v12.06,49.78
  Bottom 0.152: v14.35,43.94 14.35,46.23 12.57,48.01 12.57,49.28 v12.06,49.78
PI_RXI  (via drill 0.33)
  Top 0.152: v15.49,44.96 13.46,46.99 13.46,47.37 13.59,47.49 U$2.P$19
  Bottom 0.152: JP1.10 18.67,27.56 18.67,41.78 v15.49,44.96
PI_SCLK
  Top 0.152: JP1.23 11.58,10.01 11.58,36.09 15.11,39.62 15.11,41.53 12.93,43.71 12.93,47.6 13.22,47.89 U$2.P$18
PI_TXO  (via drill 0.33)
  Top 0.152: U$2.P$20 14.34,46.62 14.86,46.1 v15.49,46.1
  Bottom 0.152: JP1.8 18.31,29.74 18.31,41.12 14.73,44.7 14.73,45.34 v15.49,46.1
PSW  (via drill 0.33)
  Top 0.152: v29.21,62.71 29.18,62.74 28.17,62.74 27.86,62.43 27.05,62.43 26.78,62.16 U3.21
  Bottom 0.152: U3.21 26.78,62.16 27.05,62.43 27.86,62.43 28.17,62.74 29.18,62.74 v29.21,62.71
PWRBTN#  (via drill 0.33)
  Top 0.152: v28.19,63.7 27.53,63.04 26.8,63.04 26.71,62.96 U3.17 | R10.1 4.66,56.3 4.45,56.52 v2.79,56.52
  Bottom 0.152: U3.17 26.71,62.96 26.8,63.04 27.53,63.04 v28.19,63.7 28.19,63.75 29.72,65.28 29.72,66.93 28.96,67.69 27.56,67.69 27.3,67.94 26.36,67.94 26.11,67.69 18.67,67.69 17.91,68.45 17.91,71.12 12.57,76.45 12.57,76.84 13.46,77.72 13.46,80.52 12.95,81.03 4.32,81.03 1.78,78.49 1.78,57.53 v2.79,56.52
RCVR_MODE  (via drill 0.33)
  Top 0.152: v28.65,60.73 28.12,60.73 27.89,60.5 26.92,60.5 26.58,60.16 U3.31
  Bottom 0.152: U3.31 26.58,60.16 26.92,60.5 27.89,60.5 28.12,60.73 v28.65,60.73
RESET_OUT#  (via drill 0.33)
  Top 0.152: U3.36 22.25,59.36 21.82,58.93 20.5,58.93 v20.27,59.16
  Bottom 0.152: v20.27,59.16 20.5,58.93 21.82,58.93 22.25,59.36 U3.36
USB_DN  (via drill 0.33)
  Top 0.152: U3.18 22.64,62.96 22.5,63.09 20.88,63.09 20.24,63.73 v20.24,64.19
  Bottom 0.152: v20.24,64.19 20.24,63.73 20.88,63.09 22.5,63.09 22.64,62.96 U3.18
USB_DP  (via drill 0.33)
  Top 0.152: v21.16,63.75 22.3,63.75 22.7,63.36 U3.16
  Bottom 0.152: U3.16 22.7,63.36 22.3,63.75 v21.16,63.75
USB_ID  (via drill 0.33)
  Top 0.152: v27.51,66.04 27.23,65.76 U3.3
  Bottom 0.152: U3.3 27.23,65.76 v27.51,66.04
USB_VBUS  (via drill 0.33)
  Top 0.152: v19.86,63.17 20.24,62.79 22.28,62.79 22.5,62.56 U3.20
  Bottom 0.152: U3.20 22.5,62.56 22.28,62.79 20.24,62.79 v19.86,63.17
V_BAT_BKUP  (via drill 0.33)
  Top 0.152: v28.45,62.05 28.37,62.13 27.18,62.13 26.81,61.76 U3.23
  Bottom 0.152: U3.23 26.81,61.76 27.18,62.13 28.37,62.13 v28.45,62.05
VSYS  (via drill 0.33)
  Top 0.2: U3.4 U3.2 U3.4 | U3.4 U3.6 | U3.4 v22.08,65.76
  Top 0.254: C8.1 17.15,66.68 17.78,67.31 17.78,76.45 17.53,76.71 16.82,76.71 | U5.1 16.82,76.71 | 16.82,76.71 16.82,77.28 16.38,77.72 14.99,77.72 | 14.99,77.72 v12.19,77.72 | U5.3 14.93,77.66 14.99,77.72 | R9.1 1.69,79.21 | v10.79,79.63 2.11,79.63 1.69,79.21 | D3.A 1.02,79.88 1.69,79.21
  Bottom 0.2: U3.4 U3.6 | U3.4 U3.2 | v22.08,65.76 U3.4
  Bottom 0.254: v12.19,77.72 10.79,79.12 v10.79,79.63
  pour Top: 16.26,66.17 23.37,66.17 23.37,65.28 21.34,65.28 19.3,63.25 19.3,61.47 18.29,60.45 18.29,58.17 15.24,58.17 15.24,59.94 16.26,60.96

### Text on the board
Top: v01
tPlace: LED EN | PWR | Pi Breakout | POWER
bPlace: Pi Breakout | 4xM2.0
tDocu: Max Board Length | Connectors Go Here | LED's and selector switches go here | Nothing goes here... I mean it. | Shawn Hymel